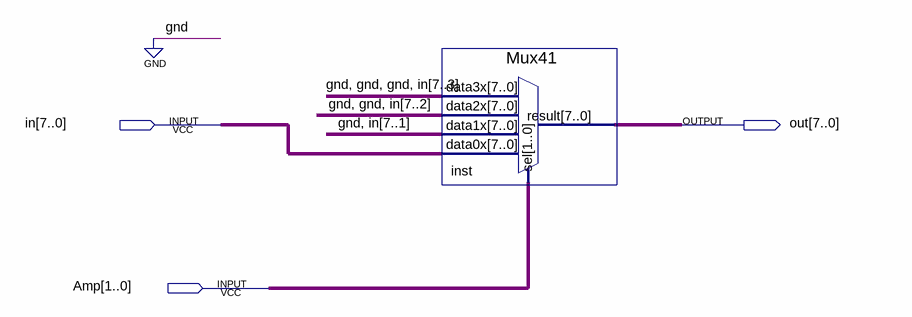
[diagram p0: schematic sheet]
// Quartus schematic AmpSel.bdf as structural Verilog: 1 symbols, 3 pins
module AmpSel (
  input  [7:0] in,
  input  [1:0] Amp,
  output [7:0] out
);

  Mux41 inst (
    .data3x({3'b000, in[7:3]}), .data2x({2'b00, in[7:2]}), .data1x({1'b0, in[7:1]}), .data0x(in), .sel(Amp),
    .result(out));
endmodule
